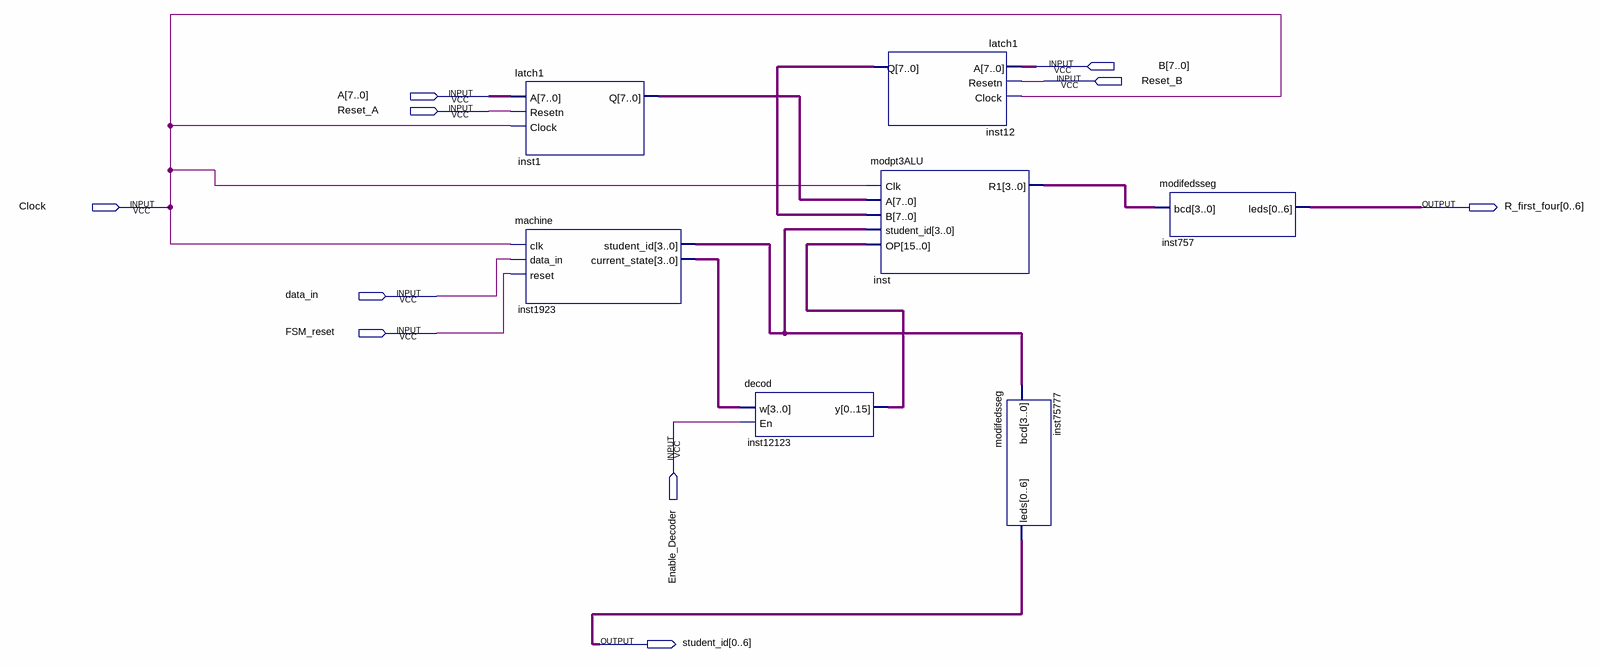
[diagram p0: schematic sheet]
// Quartus schematic figure7.bdf as structural Verilog: 7 symbols, 10 pins
module figure7 (
  input  [7:0] B,
  input  Reset_B,
  input  [7:0] A,
  input  Reset_A,
  input  Clock,
  input  data_in,
  input  FSM_reset,
  input  Enable_Decoder,
  output [0:6] R_first_four,
  output [0:6] student_id
);

  wire [3:0] inst1923_current_state, inst1923_student_id, inst_r1;
  wire [7:0] inst1_q, inst12_q;
  wire [15:0] inst12123_y;

  latch1 inst1 (.A(A), .Resetn(Reset_A), .Clock(Clock), .Q(inst1_q));
  machine inst1923 (
    .clk(Clock), .data_in(data_in), .reset(FSM_reset), .student_id(inst1923_student_id),
    .current_state(inst1923_current_state));
  decod inst12123 (.w(inst1923_current_state), .En(Enable_Decoder), .y(inst12123_y));
  latch1 inst12 (.A(B), .Resetn(Reset_B), .Clock(Clock), .Q(inst12_q));
  modpt3ALU inst (
    .Clk(Clock), .A(inst1_q), .B(inst12_q), .student_id(inst1923_student_id), .OP(inst12123_y), .R1(inst_r1));
  modifedsseg inst75777 (.bcd(inst1923_student_id), .leds(student_id));
  modifedsseg inst757 (.bcd(inst_r1), .leds(R_first_four));
endmodule
